# EAGLE design GC (EAGLE 9.6.2)
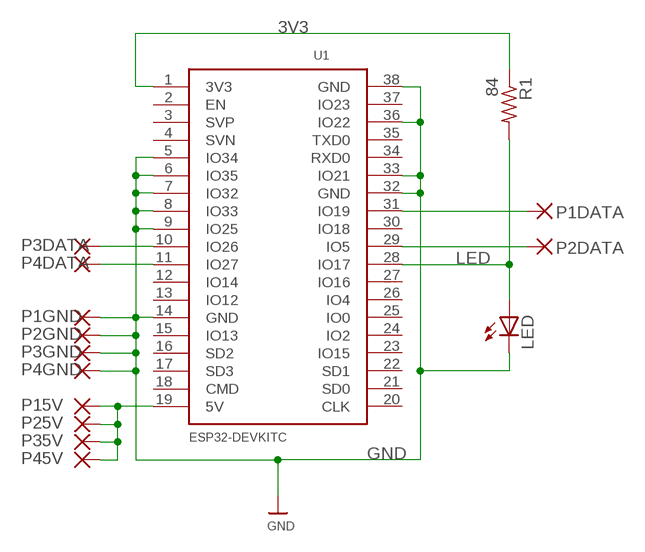
[diagram p0: schematic, sheet 1]

## Parts
LED  LEDCHIPLED_1206  [CHIPLED_1206]
P1DATA  SMD5  [SMD2,54-5,08]
P1GND  SMD5  [SMD2,54-5,08]
P2DATA  SMD5  [SMD2,54-5,08]
P2GND  SMD5  [SMD2,54-5,08]
P3DATA  SMD5  [SMD2,54-5,08]
P3GND  SMD5  [SMD2,54-5,08]
P4DATA  SMD5  [SMD2,54-5,08]
P4GND  SMD5  [SMD2,54-5,08]
P15V  SMD5  [SMD2,54-5,08]
P25V  SMD5  [SMD2,54-5,08]
P35V  SMD5  [SMD2,54-5,08]
P45V  SMD5  [SMD2,54-5,08]
R1  84  R-US_R1206  [R1206]
U1  ESP32DEVKITC  [ESP32-DEVKITC]

## Nets
3V3: R1.1 U1.1(3V3)
5V: P15V.1(P) P25V.1(P) P35V.1(P) P45V.1(P) U1.19(5V)
GND: LED.C P1GND.1(P) P2GND.1(P) P3GND.1(P) P4GND.1(P) U1.5(IO34) U1.6(IO35) U1.7(IO32) U1.8(IO33) U1.9(IO25) U1.14(GND) U1.32(GND) U1.33(IO21) U1.36(IO22) U1.38(GND)
LED: LED.A R1.2 U1.28(IO17)
P1DATA: P1DATA.1(P) U1.31(IO19)
P2DATA: P2DATA.1(P) U1.29(IO5)
P3DATA: P3DATA.1(P) U1.10(IO26)
P4DATA: P4DATA.1(P) U1.11(IO27)
Unconnected: U1.2(EN) U1.3(SVP) U1.4(SVN) U1.12(IO14) U1.13(IO12) U1.15(IO13) U1.16(SD2) U1.17(SD3) U1.18(CMD) U1.20(CLK) U1.21(SD0) U1.22(SD1) U1.23(IO15) U1.24(IO2) U1.25(IO0) U1.26(IO4) U1.27(IO16) U1.30(IO18) U1.34(RXD0) U1.35(TXD0) U1.37(IO23)

## Library data of the parts
LED = adafruit:LED: LED OSRAM: - CHIPLED LG R971, LG N971, LY N971, LG Q971, LY Q971, LO R971, LY R971 LH N974, LH R974 LS Q976, LO Q976, LY Q976 LO Q996 - Hyper CHIPLED LW Q18S LB Q993, LB Q99A, LB R99A - SideLED LS A670, LO A670, LY A670, LG A670, LP A670 LB A673, LV A673, LT A673, LW A673 LH A674 LY A675 LS A676, LA A676, LO A676, LY A676, LW A676 LS A679, LY A679, LG A679 - Hyper Micro SIDELED® LS Y876, LA Y876, LO Y876, LY Y876 LT Y87S - SmartLED LW L88C, LW L88S LB L89C, LB L89S, LG L890 LS L89K, LO L89K, LY L89K LS L896, LA L896, LO L896, LY L896 - TOPLED LS T670, LO T670, LY T670, LG T670, LP T670 LSG T670, LSP T670, LSY T670, LOP T670, LYG T670 LG T671, LOG T671, LSG T671 LB T673, LV T673, LT T673, LW T673 LH T674 LS T676, LA T676, LO T676, LY T676, LB T676, LH T676, LSB T676, LW T676 LB T67C, LV T67C, LT T67C, LS T67K, LO T67K, LY T67K, LW E67C LS E67B, LA E67B, LO E67B, LY E67B, LB E67C, LV E67C, LT E67C LW T67C LS T679, LY T679, LG T679 LS T770, LO T770, LY T770, LG T770, LP T770 LB T773, LV T773, LT T773, LW T773 LH T774 LS E675, LA E675, LY E675, LS T675 LS T776, LA T776, LO T776, LY T776, LB T776 LHGB T686 LT T68C, LB T68C - Hyper Mini TOPLED® LB M676 - Mini TOPLED Santana® LG M470 LS M47K, LO M47K, LY M47K Source: http://www.osram.convergy.de/
P1DATA P1GND P2DATA P2GND P3DATA P3GND P4DATA P4GND P15V P25V P35V P45V = wirepad:SMD5: SMD PAD
R1 = adafruit:R-US_: RESISTOR, American symbol
U1 = ESP32-DEVKITC:ESP32DEVKITC

## Board
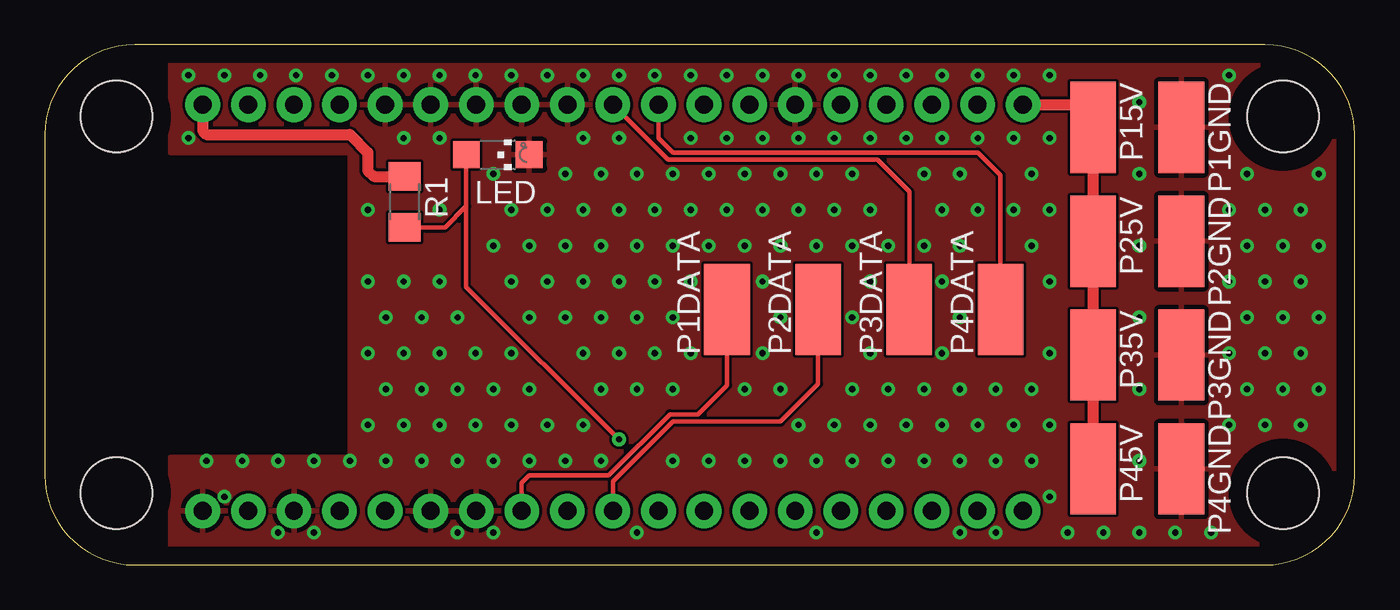
[diagram p1: board, top side]
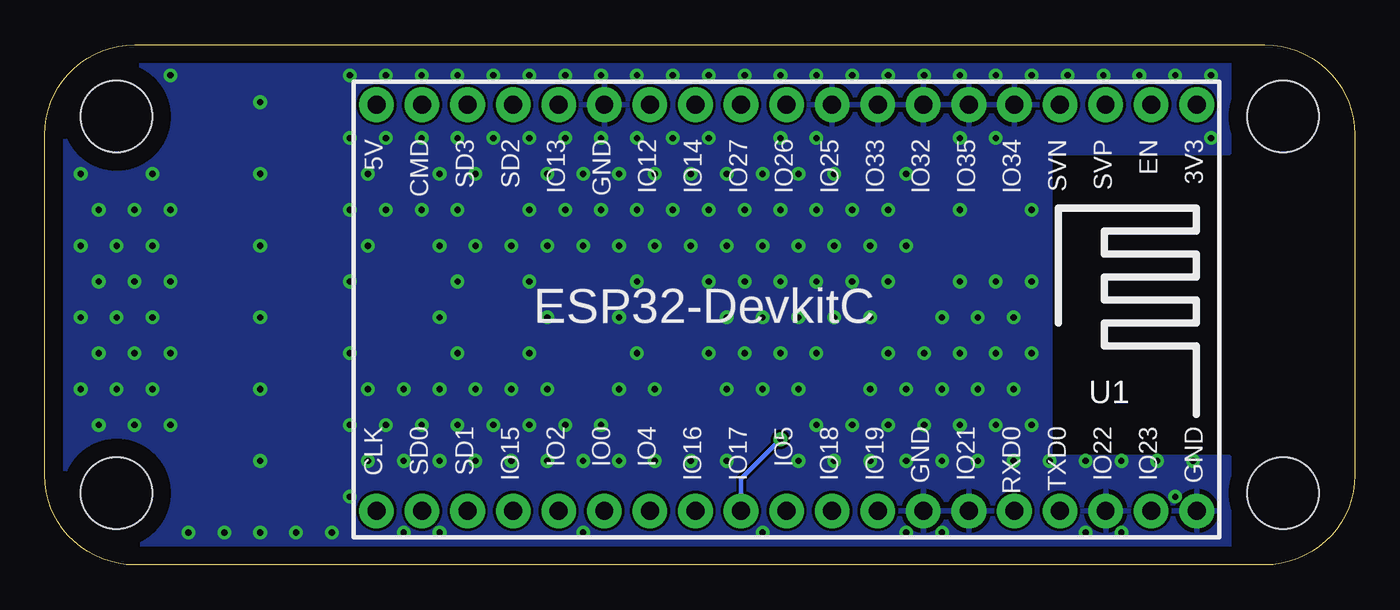
[diagram p2: board, bottom side, seen from below]

Size 73 x 29 mm. Coordinates in mm from the lower left corner, seen from the top.
Outline: 0,24 0,5 arc90 5,0 68,0 arc90 73,5 73,24 arc90 68,29 5,29 arc90 0,24
Copper layers (1*16): Top 0.035mm / dielectric 1.5mm / Bottom 0.035mm
Design rules "default": minimum track width 6mil, minimum drill 0.35mm, track to track 6mil, track to pad 6mil, pad to pad 6mil, via to via 6mil, smd to smd 6mil, copper to edge 40mil, drill to drill 6mil, minimum pad ring 10mil, minimum via ring 8mil, stop-mask expansion 4mil, vias tented up to drill 0.5mm, thermal gap 10mil
Holes 4 mm at 4,4 4,25 69,25 69,4

### Footprints (pad centres in the part's own frame; a part is rotated, then mirrored left to right if it is on the bottom)
CHIPLED_1206 = smd 1.5 x 1.5: A 0,-1.75; C 0,1.75
SMD2,54-5,08 = smd 2.54 x 5.08: 1 0,0
R1206 = smd 1.6 x 1.803: 1 -1.422,0; 2 1.422,0
ESP32-DEVKITC = drill 1 pad 1.93: 1 -22.87,-11.42; 2 -20.33,-11.42; 3 -17.79,-11.42; 4 -15.25,-11.42; 5 -12.71,-11.42; 6 -10.17,-11.42; 7 -7.63,-11.42; 8 -5.09,-11.42; 9 -2.55,-11.42; 10 -0.01,-11.42; 11 2.53,-11.42; 12 5.07,-11.42; 13 7.61,-11.42; 14 10.15,-11.42; 15 12.69,-11.42; 16 15.23,-11.42; 17 17.77,-11.42; 18 20.31,-11.42; 19 22.85,-11.42; 20 22.85,11.23; 21 20.31,11.23; 22 17.77,11.23; 23 15.23,11.23; 24 12.69,11.23; 25 10.15,11.23; 26 7.61,11.23; 27 5.07,11.23; 28 2.53,11.23; 29 -0.01,11.23; 30 -2.55,11.23; 31 -5.09,11.23; 32 -7.63,11.23; 33 -10.17,11.23; 34 -12.71,11.23; 35 -15.25,11.23; 36 -17.79,11.23; 37 -20.33,11.23; 38 -22.87,11.23

### Placement (x,y rotation side)
LED  25.24,22.87 270 top
P1DATA  38.02,14.24 0 top
P1GND  63.34,24.4 180 top
P2DATA  43.1,14.24 0 top
P2GND  63.34,18.05 180 top
P3DATA  48.18,14.24 0 top
P3GND  63.34,11.7 180 top
P4DATA  53.26,14.24 0 top
P4GND  63.34,5.35 180 top
P15V  58.42,24.4 180 top
P25V  58.42,18.05 180 top
P35V  58.42,11.7 180 top
P45V  58.42,5.35 180 top
R1  20.05,20.24 270 top
U1  31.67,14.24 180 bottom

### Tracks (layer width: path | path; a pad name or v marks a point on that pad's centre or on a via)
3V3
  Top 0.61: U1.1 8.8,24.2 9,24 17,24 18,23 18,22 18.34,21.66 R1.1
5V
  Top 0.406: 58.42,25.66 P15V.1
  Top 0.61: P15V.1 P25V.1 P35V.1 P45V.1 | U1.19 58.42,25.66
GND  (via drill 0.35)
  other vias: 9,5.8 8,23.8 8,27.3 10,3.8 11,5.8 10,27.3 13,1.8 13,5.8 12,27.3 15,1.8 15,5.8 14,27.3 17,5.8 16,27.3 19,5.8 18,7.8 19,9.8 18,11.8 19,13.8 18,15.8 18,19.8 18,27.3 21,5.8 20,7.8 21,9.8 20,11.8 21,13.8 20,15.8 20,23.8 20,27.3 23,1.8 23,5.8 22,7.8 23,9.8 22,11.8 23,13.8 22,15.8 22,19.8 22,23.8 22,27.3 25,1.8 25,5.8 24,7.8 25,9.8 24,11.8 25,17.8 25,21.8 24,27.3 27,5.8 26,7.8 27,9.8 26,11.8 27,13.8 26,15.8 27,17.8 26,19.8 26,27.3 29,5.8 28,7.8 29,13.8 28,15.8 29,17.8 28,19.8 29,21.8 28,27.3 31,5.8 30,7.8 31,9.8 30,11.8 31,13.8 30,15.8 31,17.8 30,19.8 31,21.8 30,23.8 30,27.3 33,1.8 33,9.8 32,11.8 33,13.8 32,15.8 33,17.8 32,19.8 33,21.8 32,23.8 32,27.3 35,5.8 35,9.8 34,11.8 35,13.8 34,15.8 35,17.8 34,19.8 35,21.8 34,27.3 37,5.8 36,11.8 36,15.8 37,17.8 36,19.8 37,21.8 36,23.8 36,27.3 39,5.8 39,9.8 39,17.8 38,19.8 39,21.8 38,23.8 38,27.3 41,5.8 41,9.8 40,11.8 41,13.8 40,15.8 41,17.8 40,19.8 41,21.8 40,23.8 40,27.3 43,1.8 43,5.8 42,7.8 43,17.8 42,19.8 43,21.8 42,23.8 42,27.3 45,5.8 44,7.8 45,9.8 45,13.8 45,17.8 44,19.8 45,21.8 44,23.8 44,27.3 47,5.8 46,7.8 47,9.8 46,11.8 46,15.8 47,17.8 46,19.8 46,23.8 46,27.3 49,5.8 48,7.8 49,9.8 49,17.8 49,21.8 48,23.8 48,27.3 51,1.8 51,5.8 50,7.8 51,9.8 50,11.8 51,13.8 50,15.8 51,17.8 50,19.8 51,21.8 50,23.8 50,27.3 53,1.8 53,5.8 52,7.8 53,9.8 52,19.8 52,23.8 52,27.3 55,5.8 54,7.8 55,9.8 55,17.8 54,19.8 55,21.8 54,23.8 54,27.3 57,1.8 56,3.8 56,7.8 56,11.8 56,15.8 56,19.8 56,23.8 56,27.3 59,1.8 61,1.8 61,5.8 61,9.8 61,13.8 61,17.8 61,21.8 61,25.8 63,1.8 65,1.8 66,7.8 67,9.8 66,11.8 67,13.8 66,15.8 67,17.8 66,19.8 67,21.8 66,27.3 68,7.8 69,9.8 68,11.8 69,13.8 68,15.8 69,17.8 68,19.8 70,7.8 71,9.8 70,11.8 71,13.8 70,15.8 71,17.8 70,19.8 71,21.8
  pour Top: 7,29 7,23 17,23 17,6 7,6 7,0 73,0 73,29
  pour Bottom: 7,0 73,0 73,29 7,29 7,23 17,23 17,6 7,6
LED  (via drill 0.35)
  Top 0.254: v32,7 23.49,15.51 23.49,20 | 23.49,20 LED.A | R1.2 22.31,18.82 23.49,20
  Bottom 0.254: v32,7 34.2,4.8 U1.28
P1DATA
  Top 0.254: U1.31 26.58,4.58 27,5 31.43,5 34.83,8.41 36.41,8.41 38.02,10.02 P1DATA.1
P2DATA
  Top 0.254: U1.29 31.66,4.66 35,8 41,8 43.1,10.1 P2DATA.1
P3DATA
  Top 0.254: U1.10 34.73,22.59 46.41,22.59 48.18,20.82 P3DATA.1
P4DATA
  Top 0.254: U1.11 34.2,23.8 35,23 52,23 53.26,21.74 P4DATA.1